# Altium schematic sheet Control.SchDoc
size A4; SheetNumber: 4; SheetTotal: 4
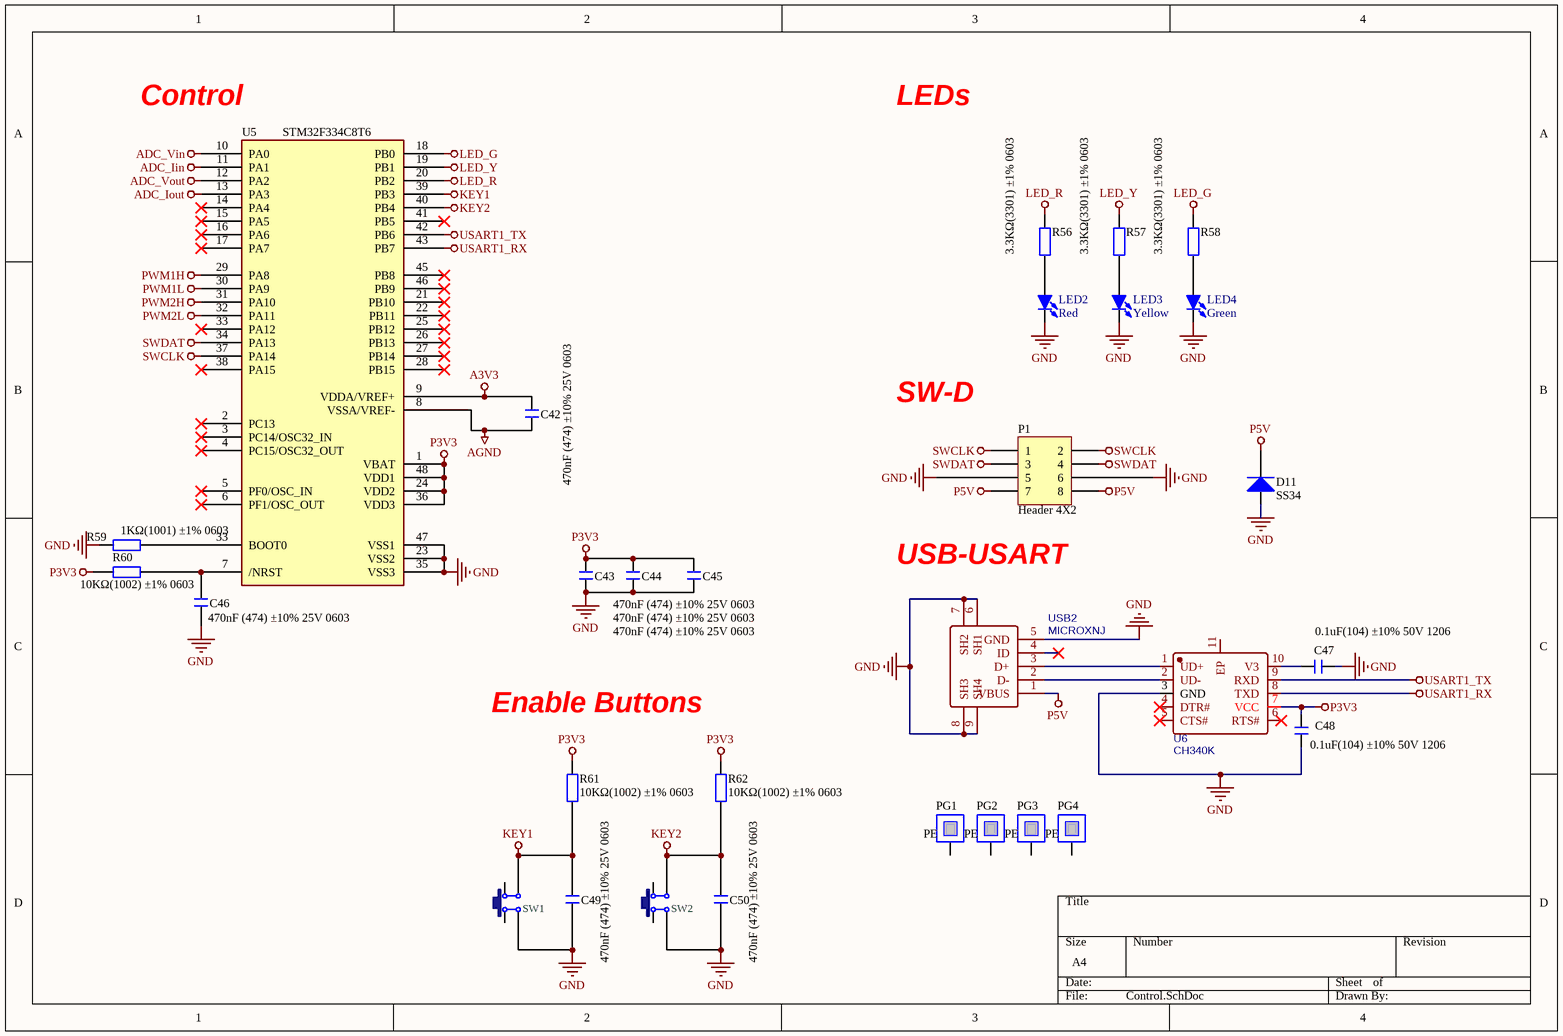
[diagram p0: Control.SchDoc]

## Parts
C42  470nF (474) ±10% 25V 0603  [C 0603_L]
C43  470nF (474) ±10% 25V 0603  [C 0603_L]
C44  470nF (474) ±10% 25V 0603  [C 0603_L]
C45  470nF (474) ±10% 25V 0603  [C 0603_L]
C46  470nF (474) ±10% 25V 0603  [C 0603_L]
C47  0.1uF(104) ±10% 50V 1206  [C 1206_M]
C48  0.1uF(104) ±10% 50V 1206  [C 1206_M]
C49  470nF (474) ±10% 25V 0603  [C 0603_L]
C50  470nF (474) ±10% 25V 0603  [C 0603_L]
D11  SS34  [SMA]
LED2  Red  [LED 0603R]
LED3  Yellow  [LED 0603R]
LED4  Green  [LED 0603R]
P1  Header 4X2  [HDR2.54-LI-2x4P]
PG1  PE  [FG-M3]  (no BOM)
PG2  PE  [FG-M3]  (no BOM)
PG3  PE  [FG-M3]  (no BOM)
PG4  PE  [FG-M3]  (no BOM)
R56  3.3KΩ(3301) ±1% 0603  [R 0603_L]
R57  3.3KΩ(3301) ±1% 0603  [R 0603_L]
R58  3.3KΩ(3301) ±1% 0603  [R 0603_L]
R59  1KΩ(1001) ±1% 0603  [R 0603_L]
R60  10KΩ(1002) ±1% 0603  [R 0603_L]
R61  10KΩ(1002) ±1% 0603  [R 0603_L]
R62  10KΩ(1002) ±1% 0603  [R 0603_L]
SW1  6x6x5  [TSW SMD-6*6*7]  (value not drawn)
SW2  6x6x5  [TSW SMD-6*6*7]  (value not drawn)
U5  STM32F334C8T6  [LQFP48-7*7]
U6  CH340K  [ESOP-10_L4.9-W3.9-P1.00-LS6.2-BL-EP]
USB2  MICROXNJ  [MICRO-USB-SMD_MICROXNJ]

## Nets
A3V3: C42.2 U5.9(VDDA/VREF+)
ADC_Iin: U5.11(PA1)
ADC_Iout: U5.13(PA3)
ADC_Vin: U5.10(PA0)
ADC_Vout: U5.12(PA2)
AGND: C42.1 U5.8(VSSA/VREF-)
GND: C43.1 C44.1 C45.1 C46.1 C47.1 C48.2 C49.1 C50.1 D11.1(A) LED2.2(K) LED3.2(K) LED4.2(K) P1.5 P1.6 R59.1 SW1.4 SW2.4 U5.23(VSS2) U5.35(VSS3) U5.47(VSS1) U6.3(GND) USB2.5(GND) USB2.6(SH1) USB2.7(SH2) USB2.8(SH3) USB2.9(SH4)
KEY1: C49.2 R61.1 SW1.3 U5.39(PB3)
KEY2: C50.2 R62.1 SW2.3 U5.40(PB4)
LED_G: R58.2 U5.18(PB0)
LED_R: R56.2 U5.20(PB2)
LED_Y: R57.2 U5.19(PB1)
P3V3: C43.2 C44.2 C45.2 C48.1 R60.1 R61.2 R62.2 U5.1(VBAT) U5.24(VDD2) U5.36(VDD3) U5.48(VDD1) U6.7(VCC)
P5V: D11.2(K) P1.7 P1.8 USB2.1(VBUS)
PWM1H: U5.29(PA8)
PWM1L: U5.30(PA9)
PWM2H: U5.31(PA10)
PWM2L: U5.32(PA11)
SWCLK: P1.1 P1.2 U5.37(PA14)
SWDAT: P1.3 P1.4 U5.34(PA13)
USART1_RX: U5.43(PB7) U6.8(TXD)
USART1_TX: U5.42(PB6) U6.9(RXD)
NetC46_2: C46.2 R60.2 U5.7(/NRST)
NetC47_2: C47.2 U6.10(V3)
NetLED2_1: LED2.1(A) R56.1
NetLED3_1: LED3.1(A) R57.1
NetLED4_1: LED4.1(A) R58.1
NetR59_2: R59.2 U5.33(PA12)
NetU6_1: U6.1(UD+) USB2.3(D+)
NetU6_2: U6.2(UD-) USB2.2(D-)

Not connected (* = marked no-connect by the designer): PG1 1; PG2 1; PG3 1; PG4 1; SW1 1 2; SW2 1 2; U5 2(PC13)* 3(PC14/OSC32_IN)* 4(PC15/OSC32_OUT)* 5(PF0/OSC_IN)* 6(PF1/OSC_OUT)* 14(PA4)* 15(PA5)* 16(PA6)* 17(PA7)* 21(PB10)* 22(PB11)* 25(PB12)* 26(PB13)* 27(PB14)* 28(PB15)* 38(PA15)* 41(PB5)* 45(PB8)* 46(PB9)*; U6 4(DTR#)* 5(CTS#)* 6(RTS#)* 11(EP); USB2 4(ID)*

## Notes on the sheet
- (near U5) Control
- LEDs
- SW-D
- USB-USART
- Enable Buttons

## Library data of the parts
C42-C50 = C: 贴片电容; BOM名称: 无极性贴片电容; 淘宝ID: 封装库来自淘宝 ID：黄晶宝石; 联系售后，技术支持: https://shop463601444.taobao.com; 唯一出售店铺网址: https://shop463601444.taobao.com
D11 = Diode: Default Diode
LED2-LED4 = LED-SMD: 贴片LED; 版权归属: 封装库来自淘宝 ID：黄晶宝石; BOM名称: 贴片LED; 学习资源: https://shop463601444.taobao.com
P1 = Header 4X2: Header, 4-Pin, Dual row; LatestRevisionDate: 17-Jul-2002; LatestRevisionNote: Re-released for DXP Platform.; Publisher: Altium Limited
PG1-PG4 = H-SINK
R56-R62 = R: 贴片电阻; 版权归属: 来自淘宝 ID：黄晶宝石; 封装库来自淘宝卖家 ID：黄晶宝石: 其他店铺购入均为盗版，不享受售后技术支持服务，请立即申请退款; BOM名称: 贴片电阻; 联系售后: https://shop463601444.taobao.com
SW1 SW2 = TSW DIP-6x6: 直插6x6轻触开关; 版权归属: 封装库来自淘宝 ID：黄晶宝石; BOM名称: 直插6x6轻触开关; 唯一出售店铺网址: https://shop463601444.taobao.com
U6 = CH340K: BOM_Manufacturer: WCH(Jiangsu Qin Heng); Contributor: LCSC; BOM_Supplier: LCSC; BOM_Supplier Part: C968586; BOM_Manufacturer Part: CH340K; BOM_JLCPCB Part Class: Extended Part; spicePre: U; spiceSymbolName: CH340K
USB2 = MICROXNJ: BOM_Manufacturer: SHOU HAN; Contributor: LCSC; BOM_Supplier: LCSC; BOM_Supplier Part: C404969; BOM_Manufacturer Part: MicroXNJ; BOM_JLCPCB Part Class: Extended Part; spicePre: U; spiceSymbolName: MICROXNJ